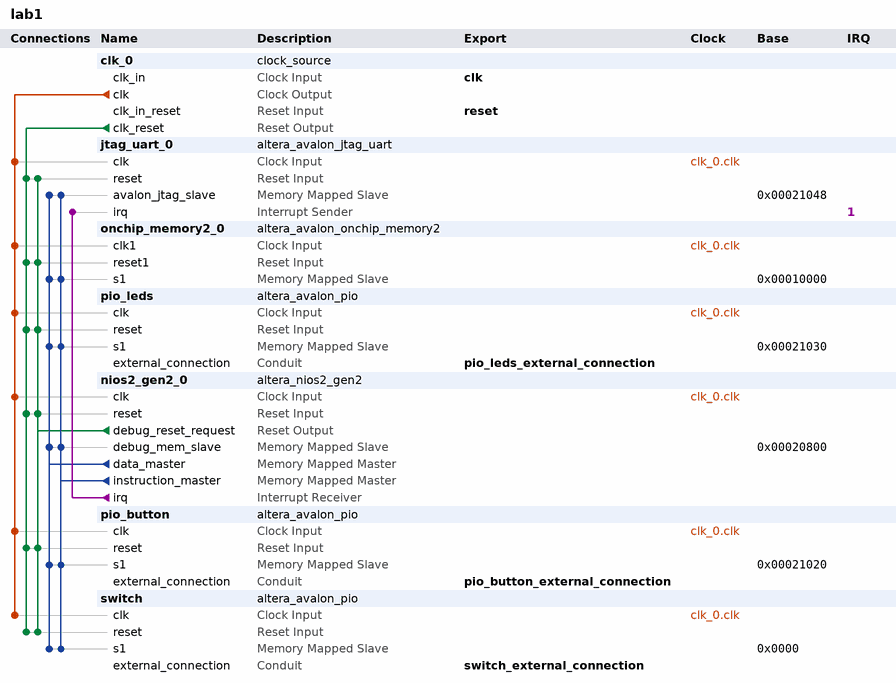
[diagram p0: system contents]
# Platform Designer (Qsys) system lab1, MAX 10 10M50DAF256I7G
# Parameters at their usual value, and those the tool derives, are not listed.
package require -exact qsys 18.1
create_system lab1
set_project_property DEVICE_FAMILY {MAX 10}
set_project_property DEVICE 10M50DAF256I7G

add_instance clk_0 clock_source 18.1
set_instance_parameter_value clk_0 clockFrequency 50000000

add_instance jtag_uart_0 altera_avalon_jtag_uart 18.1
set_instance_parameter_value jtag_uart_0 simInteractiveOptions NO_INTERACTIVE_WINDOWS

add_instance onchip_memory2_0 altera_avalon_onchip_memory2 18.1
set_instance_parameter_value onchip_memory2_0 dataWidth 32
set_instance_parameter_value onchip_memory2_0 dualPort false
set_instance_parameter_value onchip_memory2_0 initMemContent false
set_instance_parameter_value onchip_memory2_0 initializationFileName onchip_mem.hex
set_instance_parameter_value onchip_memory2_0 memorySize 40096

add_instance pio_leds altera_avalon_pio 18.1
set_instance_parameter_value pio_leds direction Output
set_instance_parameter_value pio_leds width 8

add_instance nios2_gen2_0 altera_nios2_gen2 18.1
set_instance_parameter_value nios2_gen2_0 dcache_size 2048
set_instance_parameter_value nios2_gen2_0 exceptionSlave onchip_memory2_0.s1
set_instance_parameter_value nios2_gen2_0 icache_size 4096
set_instance_parameter_value nios2_gen2_0 impl Tiny
set_instance_parameter_value nios2_gen2_0 resetSlave onchip_memory2_0.s1

add_instance pio_button altera_avalon_pio 18.1
set_instance_parameter_value pio_button direction Input
set_instance_parameter_value pio_button width 1

add_instance switch altera_avalon_pio 18.1
set_instance_parameter_value switch direction Input
set_instance_parameter_value switch width 4

# connections
add_connection clk_0.clk jtag_uart_0.clk clock
add_connection clk_0.clk nios2_gen2_0.clk clock
add_connection clk_0.clk onchip_memory2_0.clk1 clock
add_connection clk_0.clk pio_button.clk clock
add_connection clk_0.clk pio_leds.clk clock
add_connection clk_0.clk switch.clk clock
add_connection clk_0.clk_reset jtag_uart_0.reset reset
add_connection clk_0.clk_reset nios2_gen2_0.reset reset
add_connection clk_0.clk_reset onchip_memory2_0.reset1 reset
add_connection clk_0.clk_reset pio_button.reset reset
add_connection clk_0.clk_reset pio_leds.reset reset
add_connection clk_0.clk_reset switch.reset reset
add_connection nios2_gen2_0.debug_reset_request jtag_uart_0.reset reset
add_connection nios2_gen2_0.debug_reset_request nios2_gen2_0.reset reset
add_connection nios2_gen2_0.debug_reset_request onchip_memory2_0.reset1 reset
add_connection nios2_gen2_0.debug_reset_request pio_button.reset reset
add_connection nios2_gen2_0.debug_reset_request pio_leds.reset reset
add_connection nios2_gen2_0.debug_reset_request switch.reset reset
add_connection nios2_gen2_0.data_master jtag_uart_0.avalon_jtag_slave avalon
set_connection_parameter_value nios2_gen2_0.data_master/jtag_uart_0.avalon_jtag_slave baseAddress 0x00021048
add_connection nios2_gen2_0.data_master nios2_gen2_0.debug_mem_slave avalon
set_connection_parameter_value nios2_gen2_0.data_master/nios2_gen2_0.debug_mem_slave baseAddress 0x00020800
add_connection nios2_gen2_0.data_master onchip_memory2_0.s1 avalon
set_connection_parameter_value nios2_gen2_0.data_master/onchip_memory2_0.s1 baseAddress 0x00010000
add_connection nios2_gen2_0.data_master pio_button.s1 avalon
set_connection_parameter_value nios2_gen2_0.data_master/pio_button.s1 baseAddress 0x00021020
add_connection nios2_gen2_0.data_master pio_leds.s1 avalon
set_connection_parameter_value nios2_gen2_0.data_master/pio_leds.s1 baseAddress 0x00021030
add_connection nios2_gen2_0.data_master switch.s1 avalon
set_connection_parameter_value nios2_gen2_0.data_master/switch.s1 baseAddress 0x0000
add_connection nios2_gen2_0.instruction_master jtag_uart_0.avalon_jtag_slave avalon
set_connection_parameter_value nios2_gen2_0.instruction_master/jtag_uart_0.avalon_jtag_slave baseAddress 0x00021048
add_connection nios2_gen2_0.instruction_master nios2_gen2_0.debug_mem_slave avalon
set_connection_parameter_value nios2_gen2_0.instruction_master/nios2_gen2_0.debug_mem_slave baseAddress 0x00020800
add_connection nios2_gen2_0.instruction_master onchip_memory2_0.s1 avalon
set_connection_parameter_value nios2_gen2_0.instruction_master/onchip_memory2_0.s1 baseAddress 0x00010000
add_connection nios2_gen2_0.instruction_master pio_button.s1 avalon
set_connection_parameter_value nios2_gen2_0.instruction_master/pio_button.s1 baseAddress 0x00021020
add_connection nios2_gen2_0.instruction_master pio_leds.s1 avalon
set_connection_parameter_value nios2_gen2_0.instruction_master/pio_leds.s1 baseAddress 0x00021030
add_connection nios2_gen2_0.instruction_master switch.s1 avalon
set_connection_parameter_value nios2_gen2_0.instruction_master/switch.s1 baseAddress 0x0000
add_connection nios2_gen2_0.irq jtag_uart_0.irq interrupt
set_connection_parameter_value nios2_gen2_0.irq/jtag_uart_0.irq irqNumber 1

# exported interfaces
add_interface clk clock sink
set_interface_property clk EXPORT_OF clk_0.clk_in
add_interface pio_button_external_connection conduit end
set_interface_property pio_button_external_connection EXPORT_OF pio_button.external_connection
add_interface pio_leds_external_connection conduit end
set_interface_property pio_leds_external_connection EXPORT_OF pio_leds.external_connection
add_interface reset reset sink
set_interface_property reset EXPORT_OF clk_0.clk_in_reset
add_interface switch_external_connection conduit end
set_interface_property switch_external_connection EXPORT_OF switch.external_connection

set_interconnect_requirement {$system} qsys_mm.clockCrossingAdapter HANDSHAKE
set_interconnect_requirement {$system} qsys_mm.enableEccProtection FALSE
set_interconnect_requirement {$system} qsys_mm.insertDefaultSlave FALSE
set_interconnect_requirement {$system} qsys_mm.maxAdditionalLatency 1

save_system lab1.qsys
